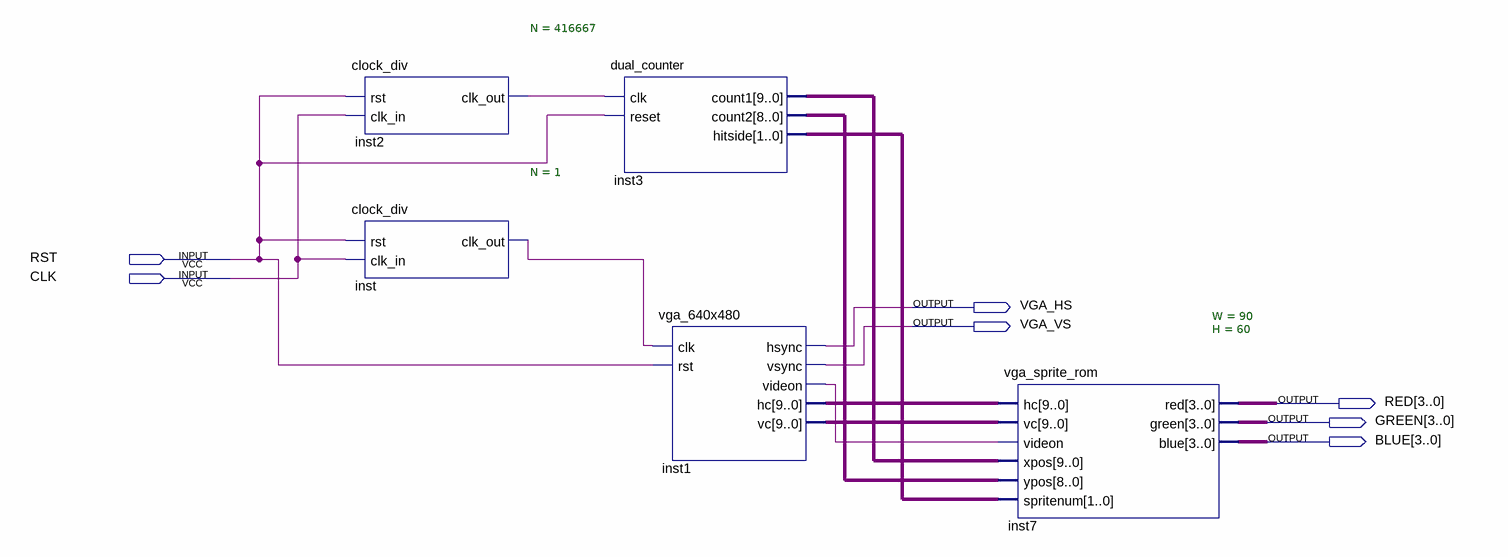
[diagram p0: schematic sheet]
// Quartus schematic top.bdf as structural Verilog: 5 symbols, 7 pins
module top (
  input  RST,
  input  CLK,
  output VGA_HS,
  output VGA_VS,
  output [3:0] RED,
  output [3:0] GREEN,
  output [3:0] BLUE
);

  wire inst1_videon, inst2_clk_out, inst_clk_out;
  wire [1:0] inst3_hitside;
  wire [8:0] inst3_count2;
  wire [9:0] inst1_hc, inst1_vc, inst3_count1;

  clock_div #(.N(416667)) inst2 (.rst(RST), .clk_in(CLK), .clk_out(inst2_clk_out));
  clock_div #(.N(1)) inst (.rst(RST), .clk_in(CLK), .clk_out(inst_clk_out));
  dual_counter inst3 (
    .clk(inst2_clk_out), .reset(RST), .count1(inst3_count1), .count2(inst3_count2), .hitside(inst3_hitside));
  vga_640x480 inst1 (
    .clk(inst_clk_out), .rst(RST), .hsync(VGA_HS), .vsync(VGA_VS), .videon(inst1_videon), .hc(inst1_hc),
    .vc(inst1_vc));
  vga_sprite_rom #(.W(90), .H(60)) inst7 (
    .hc(inst1_hc), .vc(inst1_vc), .videon(inst1_videon), .xpos(inst3_count1), .ypos(inst3_count2),
    .spritenum(inst3_hitside), .red(RED), .green(GREEN), .blue(BLUE));
endmodule
